# Altium schematic sheet MCU.SchDoc
size A; SheetNumber: 2; SheetTotal: 4
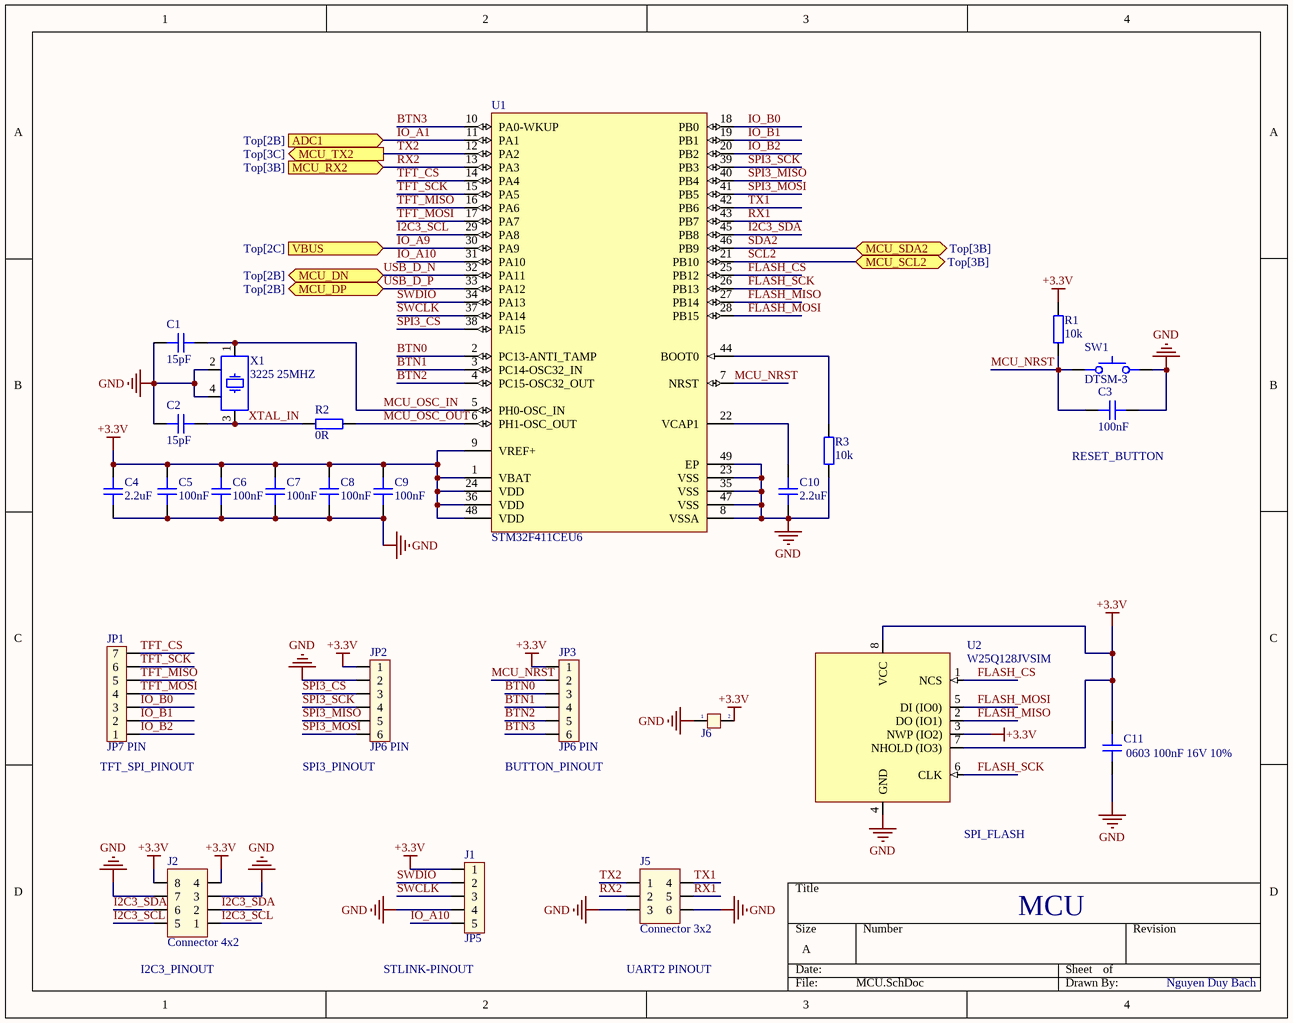
[diagram p0: MCU.SchDoc]

## Parts
C1  15pF  [CAP_0603]
C2  15pF  [CAP_0603]
C3  100nF  [CAP_0603]
C4  2.2uF  [CAP_0805]
C5  100nF  [CAP_0603]
C6  100nF  [CAP_0603]
C7  100nF  [CAP_0603]
C8  100nF  [CAP_0603]
C9  100nF  [CAP_0603]
C10  2.2uF  [CAP_0805]
C11  0603 100nF 16V 10%  [CAP_0603]
J1  JP5  [JP5]
J2  Connector 4x2  [JP4x2]
J5  Connector 3x2  [JP3x2]
J6  Jumper 2  [JP2]  (value not drawn)
JP1  JP7 PIN  [JP7]
JP2  JP6 PIN  [JP6]
JP3  JP6 PIN  [JP6]
R1  10k  [RES_0603]
R2  0R  [RES_0603]
R3  10k  [RES_0603]
SW1  DTSM-3  [DTSM-3]
U1  STM32F411CEU6  [STM-UFQFPN48_L]
U2  W25Q128JVSIM  [SOIC-8]
X1  3225 25MHZ  [XTAL_3225]

## Ports
ADC1 (in, see Top[2B]), MCU_DN (bidir, see Top[2B]), MCU_DP (bidir, see Top[2B]), MCU_RX2 (in, see Top[3B]), MCU_SCL2 (bidir, see Top[3B]), MCU_SDA2 (bidir, see Top[3B]), MCU_TX2 (out, see Top[3C]), VBUS (in, see Top[2C])

## Nets
+3.3V: C4.2 C5.2 C6.2 C7.2 C8.2 C9.2 C11.2 J1.1 J2.4 J2.8 J6.2 JP2.1 JP3.1 R1.2 U1.1(VBAT) U1.9(VREF+) U1.24(VDD) U1.36(VDD) U1.48(VDD) U2.3(NWP_(IO2)) U2.7(NHOLD_(IO3)) U2.8(VCC)
GND: C1.2 C2.2 C3.1 C4.1 C5.1 C6.1 C7.1 C8.1 C9.1 C10.1 C11.1 J1.4 J2.3 J2.7 J5.3 J5.6 J6.1 JP2.2 R3.1 SW1.2 U1.8(VSSA) U1.23(VSS) U1.35(VSS) U1.47(VSS) U1.49(EP) U2.4(GND) X1.2 X1.4
BTN0: JP3.3 U1.2(PC13-ANTI_TAMP)
BTN1: JP3.4 U1.3(PC14-OSC32_IN)
BTN2: JP3.5 U1.4(PC15-OSC32_OUT)
BTN3: JP3.6 U1.10(PA0-WKUP)
FLASH_CS: U1.25(PB12) U2.1(NCS)
FLASH_MISO: U1.27(PB14) U2.2(DO_(IO1))
FLASH_MOSI: U1.28(PB15) U2.5(DI_(IO0))
FLASH_SCK: U1.26(PB13) U2.6(CLK)
I2C3_SCL: J2.1 J2.5 U1.29(PA8)
I2C3_SDA: J2.2 J2.6 U1.45(PB8)
IO_A1: U1.11(PA1) ; port ADC1
IO_A9: U1.30(PA9) ; port VBUS
IO_A10: J1.5 U1.31(PA10)
IO_B0: JP1.3 U1.18(PB0)
IO_B1: JP1.2 U1.19(PB1)
IO_B2: JP1.1 U1.20(PB2)
MCU_NRST: C3.2 JP3.2 R1.1 SW1.1 U1.7(NRST)
MCU_OSC_IN: C1.1 U1.5(PH0-OSC_IN) X1.1
MCU_OSC_OUT: R2.1 U1.6(PH1-OSC_OUT)
RX1: J5.5 U1.43(PB7)
RX2: J5.2 U1.13(PA3) ; port MCU_RX2
SCL2: U1.21(PB10) ; port MCU_SCL2
SDA2: U1.46(PB9) ; port MCU_SDA2
SPI3_CS: JP2.3 U1.38(PA15)
SPI3_MISO: JP2.5 U1.40(PB4)
SPI3_MOSI: JP2.6 U1.41(PB5)
SPI3_SCK: JP2.4 U1.39(PB3)
SWCLK: J1.3 U1.37(PA14)
SWDIO: J1.2 U1.34(PA13)
TFT_CS: JP1.7 U1.14(PA4)
TFT_MISO: JP1.5 U1.16(PA6)
TFT_MOSI: JP1.4 U1.17(PA7)
TFT_SCK: JP1.6 U1.15(PA5)
TX1: J5.4 U1.42(PB6)
TX2: J5.1 U1.12(PA2) ; port MCU_TX2
USB_D_N: U1.32(PA11) ; port MCU_DN
USB_D_P: U1.33(PA12) ; port MCU_DP
XTAL_IN: C2.1 R2.2 X1.3
NetC10_2: C10.2 U1.22(VCAP1)
NetR3_2: R3.2 U1.44(BOOT0)

## Notes on the sheet
- (near C3) RESET_BUTTON
- (near JP1) TFT_SPI_PINOUT
- (near JP2) SPI3_PINOUT
- (near JP3) BUTTON_PINOUT
- (near U2) SPI_FLASH
- (near J2) I2C3_PINOUT
- (near J1) STLINK-PINOUT
- UART2 PINOUT
- MCU
- Nguyen Duy Bach

## Library data of the parts
C1-C3 C5-C9 C11 = CAP_0603: Capacitor SMD 0603; Manufacturer: *; Manufacturer Part Number: *; Distributor Link: *; LCSC: *; Rating: *; Dielectric: *
C4 C10 = CAP_0805: Capacitor SMD 0805; Manufacturer: *; Manufacturer Part Number: *; Distributor Link: *; LCSC: *; Rating: *; Dielectric: *
J2 = JP4x2: Value: Connector 4x2
J5 = JP3x2: Value: Connector 3x2
J6 = JP 2: Value: JP 2
JP1 = JP7: Value: JP7
JP2 JP3 = JP6: Value: JP7
R1-R3 = RES_0603: Resistor SMD 0603; Manufacturer: *; Manufacturer Part Number: *; Distributor Link: *; LCSC: *
SW1 = DTSM-3: Tactile Switch SMD SPST; Manufacturer: Diptronics; Manufacturer Part Number: DTSM-3
U1 = CMP-0243-00165-1: ARM Cortex-M4 32-bit MCU+FPU, 512 KB Flash, 128 KB RAM, 36 I/Os, 48-Pin UFQFPN, -40 to 85 degC, Tray; Operating Frequency(F) (Processor speed) (MHz): 100; FLASH Size (Prog) (kB): 512; Internal RAM Size (kB): 128; I/Os (High Current): 36; Supply Voltage(Vcc) min (V): 1.7; Package Reference: 48-Pin Ultra Thin Fine Pitch Quad Flat No-Lead, 7 x 7 x 0.6 mm Body, 0.5 mm Pitch, Exposed Pad; ComponentLink1Description: Manufacturer URL; ComponentLink1URL: http://www.st.com/; Packing: Tray; Package Description: UFQFPN48; Core: ARM Cortex-M4; ComponentLink2Description: Datasheet; ComponentLink2URL: http://www.st.com/st-web-ui/static/active/en/resource/technical/document/datasheet/DM00115249.pdf; DatasheetVersion: Rev. 6; Mounting Technology: Surface Mount
U2 = W25Q128JVSIM: 128M-BIT / SERIAL FLASH MEMORY WITH / DUAL/QUAD SPI & QPI & DTR SOIC-8; Manufacturer: Winbond; Manufacturer Part Number: W25Q128JVSIM
X1 = XTAL 4 Pin: Crystal Oscillator; Distributor Link: *